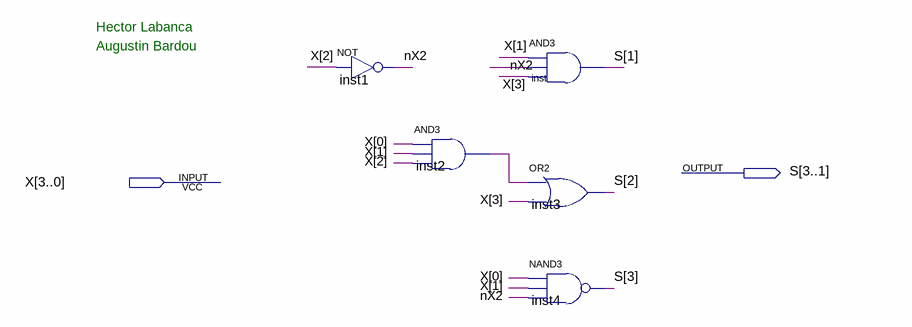
[diagram p0: schematic sheet]
// Quartus schematic exo1.bdf as structural Verilog: 5 symbols, 2 pins
module exo1 (
  input  [3:0] X,
  output [3:1] S
);

  wire inst2_out, nX2;

  not inst1 (nX2, X[2]);
  and inst2 (inst2_out, X[0], X[1], X[2]);
  and inst (S[1], X[1], nX2, X[3]);
  or inst3 (S[2], inst2_out, X[3]);
  nand inst4 (S[3], X[0], X[1], nX2);

  // Notes on the sheet:
  //   Hector Labanca
  //   Augustin Bardou
endmodule
